# EAGLE design v1 (EAGLE 6.4)
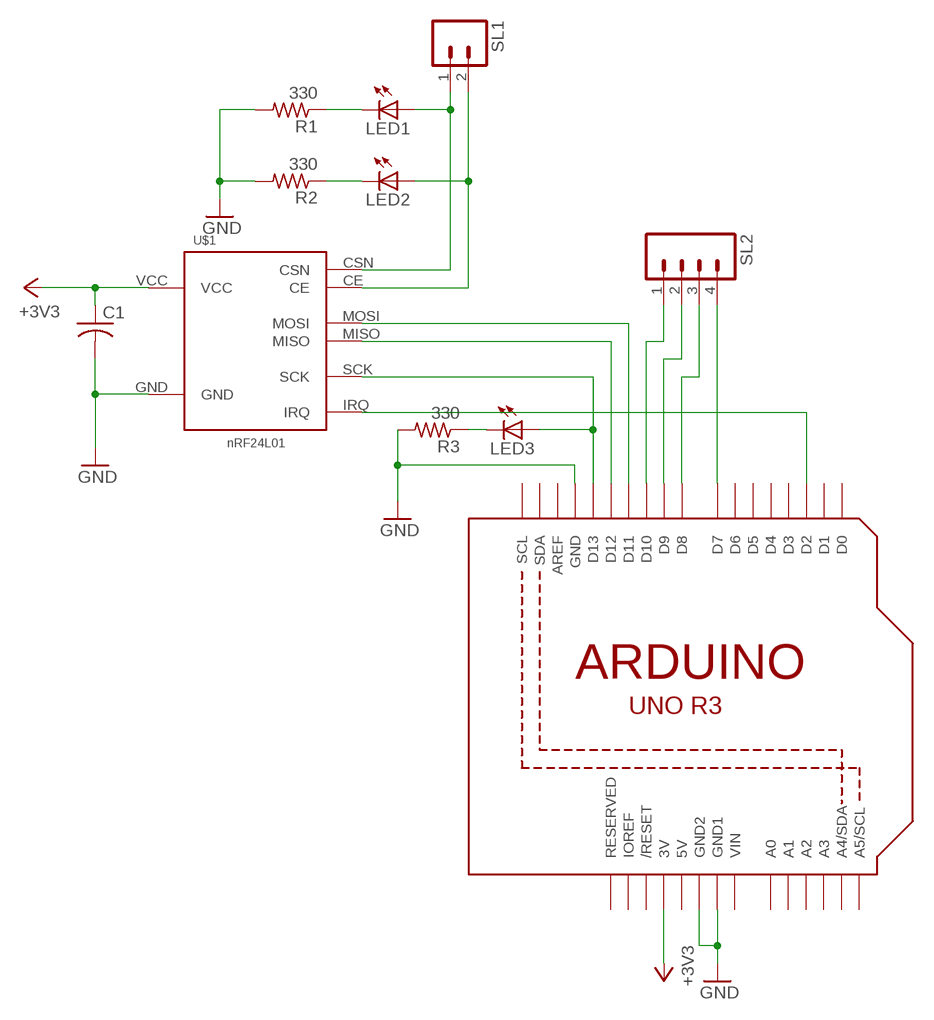
[diagram p0: schematic, sheet 1]

## Parts
C1  C-USC0603  [C0603]
LED1  LED5MM  [LED5MM]
LED2  LED5MM  [LED5MM]
LED3  LED5MM  [LED5MM]
R1  330  R-US_R0603  [R0603]
R2  330  R-US_R0603  [R0603]
R3  330  R-US_R0603  [R0603]
SL1  M02  [02P]
SL2  M04  [04P]
U1  ARDUINOR3-DIMENSION  [ARDUINOR3]
U$1  NRF24L01MODULE  [NRF24L01-MODULE]

## Nets
+3V3: C1.1 U1.3V U$1.VCC
GND: C1.2 R1.2 R2.2 R3.2 U1.GND U1.GND1 U1.GND2 U$1.GND
N$1: SL2.4 U1.D7
N$2: SL2.3 U1.D8
N$3: LED3.A U1.D13 U$1.SCK
N$4: U1.D12 U$1.MISO
N$5: U1.D11 U$1.MOSI
N$6: U1.D2 U$1.IRQ
N$7: SL2.2 U1.D9
N$8: SL2.1 U1.D10
N$9: LED1.A SL1.1 U$1.CSN
N$10: LED2.A SL1.2 U$1.CE
N$11: LED1.K(C) R1.1
N$12: LED2.K(C) R2.1
N$13: LED3.K(C) R3.1
Unconnected: U1.A0 U1.A1 U1.A2 U1.A3 U1.A4(A4/SDA) U1.A5(A5/SCL) U1.AREF U1.D0 U1.D1 U1.D3 U1.D4 U1.D5 U1.D6 U1.IOREF U1.RESERVED U1.RESET(/RESET) U1.SCL U1.SDA

## Power pins joined to a net without a drawn wire
5V: U1.5V
VIN: U1.VIN

## Library data of the parts
C1 = adafruit:C-US: CAPACITOR, American symbol
LED1-LED3 = adafruit:LED: LED OSRAM: - CHIPLED LG R971, LG N971, LY N971, LG Q971, LY Q971, LO R971, LY R971 LH N974, LH R974 LS Q976, LO Q976, LY Q976 LO Q996 - Hyper CHIPLED LW Q18S LB Q993, LB Q99A, LB R99A - SideLED LS A670, LO A670, LY A670, LG A670, LP A670 LB A673, LV A673, LT A673, LW A673 LH A674 LY A675 LS A676, LA A676, LO A676, LY A676, LW A676 LS A679, LY A679, LG A679 - Hyper Micro SIDELED® LS Y876, LA Y876, LO Y876, LY Y876 LT Y87S - SmartLED LW L88C, LW L88S LB L89C, LB L89S, LG L890 LS L89K, LO L89K, LY L89K LS L896, LA L896, LO L896, LY L896 - TOPLED LS T670, LO T670, LY T670, LG T670, LP T670 LSG T670, LSP T670, LSY T670, LOP T670, LYG T670 LG T671, LOG T671, LSG T671 LB T673, LV T673, LT T673, LW T673 LH T674 LS T676, LA T676, LO T676, LY T676, LB T676, LH T676, LSB T676, LW T676 LB T67C, LV T67C, LT T67C, LS T67K, LO T67K, LY T67K, LW E67C LS E67B, LA E67B, LO E67B, LY E67B, LB E67C, LV E67C, LT E67C LW T67C LS T679, LY T679, LG T679 LS T770, LO T770, LY T770, LG T770, LP T770 LB T773, LV T773, LT T773, LW T773 LH T774 LS E675, LA E675, LY E675, LS T675 LS T776, LA T776, LO T776, LY T776, LB T776 LHGB T686 LT T68C, LB T68C - Hyper Mini TOPLED® LB M676 - Mini TOPLED Santana® LG M470 LS M47K, LO M47K, LY M47K Source: http://www.osram.convergy.de/
R1-R3 = adafruit:R-US_: RESISTOR, American symbol
SL1 = con-amp-quick:M02: AMP QUICK CONNECTOR; OC_FARNELL: unknown; OC_NEWARK: unknown
SL2 = con-amp-quick:M04: AMP QUICK CONNECTOR; OC_FARNELL: unknown; OC_NEWARK: unknown
U1 = adafruit:ARDUINOR3: This is a new object for the new Arduino R3 - with extra pins that you may want to use (such as IOref, and duplicated A4/A5
U$1 = serge:NRF24L01

## Board
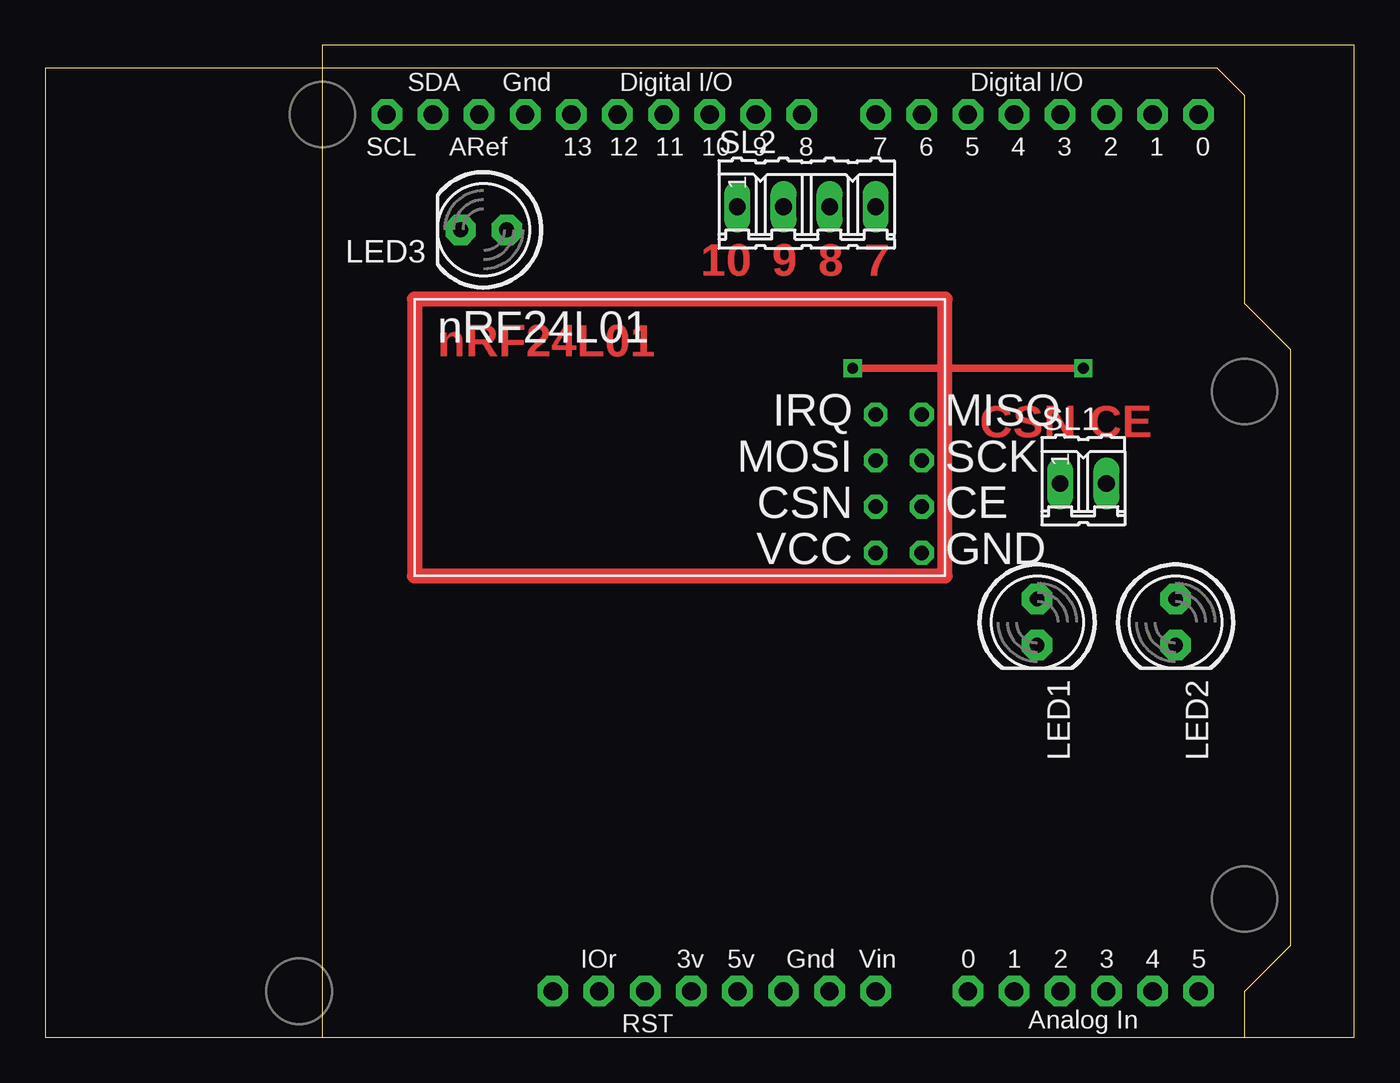
[diagram p1: board, top side]
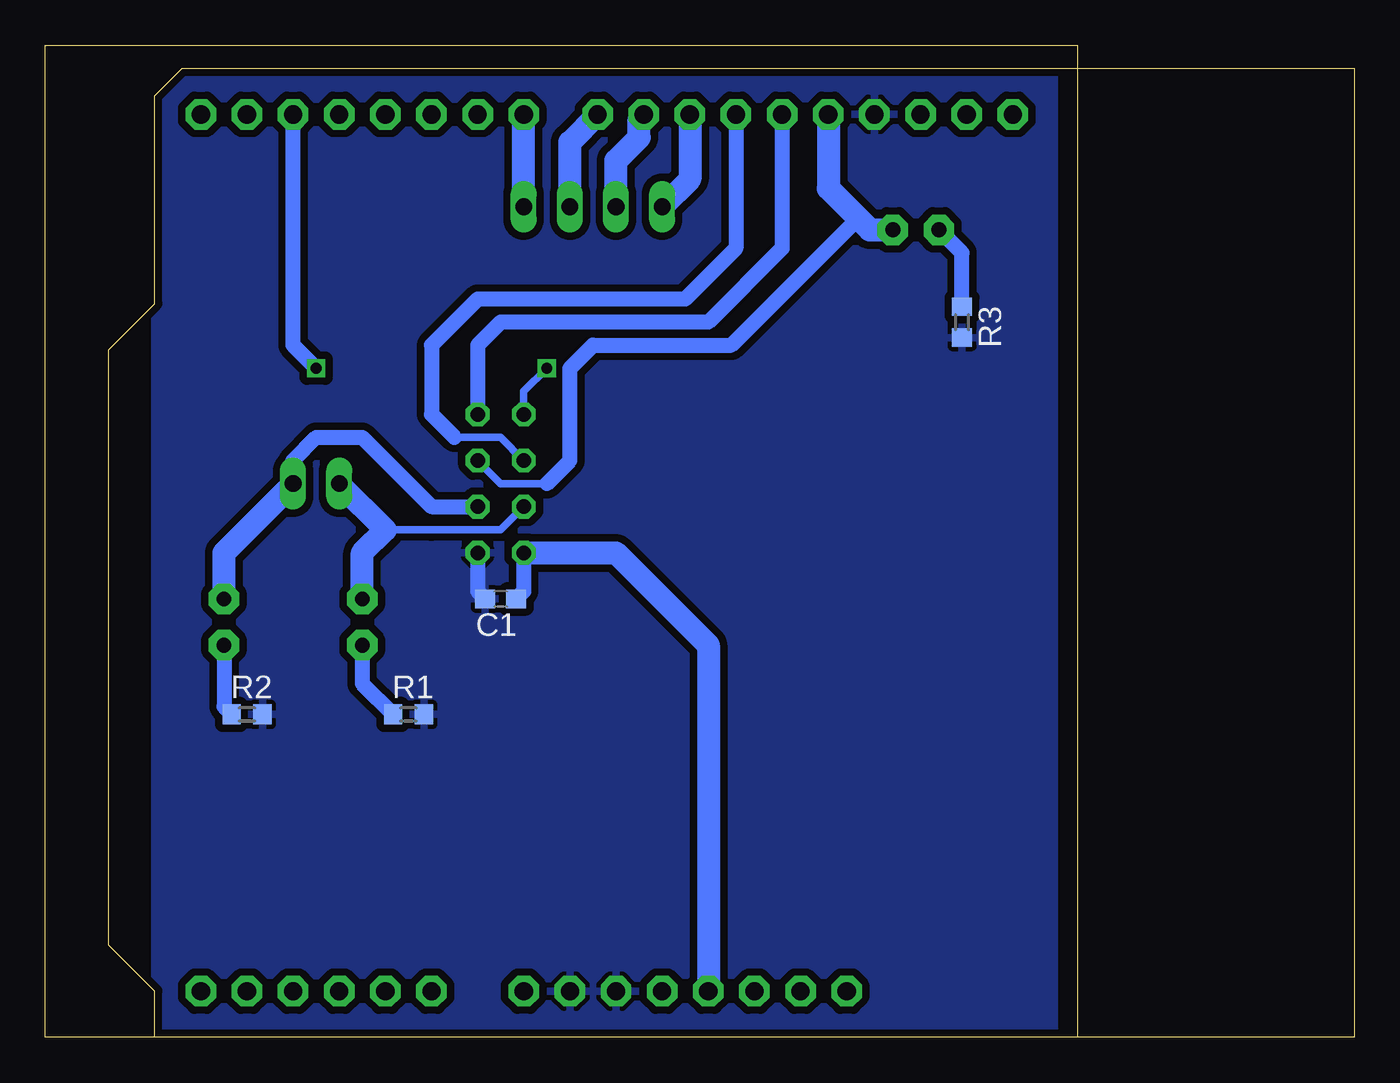
[diagram p2: board, bottom side, seen from below]

Size 56.82 x 54.6 mm. Coordinates in mm from the lower left corner, seen from the top.
Outline: 0,0 56.82,0 56.82,54.6 0,54.6 0,0
Copper layers (1*16): Top 0.035mm / dielectric 1.5mm / Bottom 0.035mm
Design rules "default": minimum track width 10mil, minimum drill 24mil, track to track 16mil, track to pad 16mil, pad to pad 16mil, via to via 16mil, smd to smd 16mil, copper to edge 16mil, drill to drill 8mil, minimum pad ring 10mil, minimum via ring 8mil, stop-mask expansion 4mil, vias tented up to drill 0mil, thermal gap 10mil

### Footprints (pad centres in the part's own frame; a part is rotated, then mirrored left to right if it is on the bottom)
C0603 = smd 1.1 x 1: 1 -0.85,0; 2 0.85,0
LED5MM = drill 0.813 pad 1.676 octagon: A -1.27,0; K 1.27,0
R0603 = smd 1 x 1.1: 1 -0.85,0; 2 0.85,0
02P = drill 0.914 long: 1 -1.27,0; 2 1.27,0
04P = drill 0.914 long: 1 -3.81,0; 2 -1.27,0; 3 1.27,0; 4 3.81,0
ARDUINOR3 = drill 1 pad 1.676 octagon: 3V 35.56,2.54; 5V 38.1,2.54; A0 50.8,2.54; A1 53.34,2.54; A2 55.88,2.54; A3 58.42,2.54; A4 60.96,2.54; A5 63.5,2.54; AREF 23.876,50.8; D0 63.5,50.8; D1 60.96,50.8; D2 58.42,50.8; D3 55.88,50.8; D4 53.34,50.8; D5 50.8,50.8; D6 48.26,50.8; D7 45.72,50.8; D8 41.656,50.8; D9 39.116,50.8; D10 36.576,50.8; D11 34.036,50.8; D12 31.496,50.8; D13 28.956,50.8; GND 26.416,50.8; GND1 43.18,2.54; GND2 40.64,2.54; IOREF 30.48,2.54; RESERVED 27.94,2.54; RESET 33.02,2.54; SCL 18.796,50.8; SDA 21.336,50.8; VIN 45.72,2.54
NRF24L01-MODULE = drill 0.8 octagon: CE 10.16,-2.54; CSN 7.62,-2.54; GND 10.16,-5.08; IRQ 7.62,2.54; MISO 10.16,2.54; MOSI 7.62,0; SCK 10.16,0; VCC 7.62,-5.08

### Placement (x,y rotation side)
C1  31.75,24.13 180 bottom
LED1  39.37,22.86 270 top
LED2  46.99,22.86 270 top
LED3  8.89,44.45 180 top
R1  36.83,17.78 0 bottom
R2  45.72,17.78 0 bottom
R3  6.35,39.37 270 bottom
SL1  41.91,30.48 0 top
SL2  26.67,45.72 0 top
U1  -15.24,0 0 top
U$1  22.86,31.75 0 top

### Tracks (layer width: path | path; a pad name or v marks a point on that pad's centre or on a via)
+3V3
  Bottom 0.813: U$1.VCC 30.48,24.55 C1.1
  Bottom 1.27: U$1.VCC 25.4,26.67 20.32,21.59 U1.3V
GND
  Bottom 0.813: U$1.GND 33.02,24.55 C1.2
  pour Bottom: 1.27,53.34 50.8,53.34 50.8,0 1.27,0
N$1
  Bottom 1.27: SL2.4 U1.D7
N$2
  Bottom 1.27: SL2.3 27.94,49.28 U1.D8
N$3
  Bottom 0.406: U$1.SCK 31.75,30.48 29.21,30.48
  Bottom 0.813: 29.21,30.48 27.94,31.75 27.94,36.83 26.67,38.1 19.05,38.1 12.06,45.09
  Bottom 1.27: U1.D13 13.72,46.74 12.06,45.09 11.43,44.45 LED3.A
N$4
  Bottom 0.813: U1.D12 16.26,43.43 20.32,39.37 31.75,39.37 33.02,38.1 U$1.MISO
N$5
  Bottom 0.406: U$1.MOSI 31.75,33.02 34.29,33.02
  Bottom 0.813: U1.D11 18.8,43.43 21.59,40.64 33.02,40.64 35.56,38.1 35.56,34.29 34.29,33.02
N$6  (via drill 0.6)
  Top 0.406: v29.21,36.83 v41.91,36.83
  Bottom 0.406: U$1.IRQ 30.48,35.56 v29.21,36.83
  Bottom 0.813: U1.D2 43.18,38.1 v41.91,36.83
N$7
  Bottom 1.27: SL2.2 25.4,48.26 24.13,49.53 24.13,50.55 U1.D9
N$8
  Bottom 1.27: U1.D10 21.34,47.24 SL2.1
N$9
  Bottom 0.406: U$1.CSN 31.75,27.94 35.56,27.94 38.1,27.94
  Bottom 1.27: SL1.1 38.1,27.94 39.37,26.67 LED1.A
N$10
  Bottom 0.813: SL1.2 43.18,31.75 41.91,33.02 39.37,33.02 35.56,29.21 U$1.CE
  Bottom 1.27: LED2.A 46.99,26.67 SL1.2
N$11
  Bottom 0.813: LED1.K 39.37,19.47 R1.1
N$12
  Bottom 0.813: LED2.K 46.99,18.2 R2.1
N$13
  Bottom 0.813: R3.1 6.35,43.18 LED3.K
N$14
  Top 0.813: 5.08,40.64 5.08,25.4 34.29,25.4 34.29,40.64 5.08,40.64

### Text on the board
Top: 10 | 9 | 8 | 7 | nRF24L01 | CSN CE